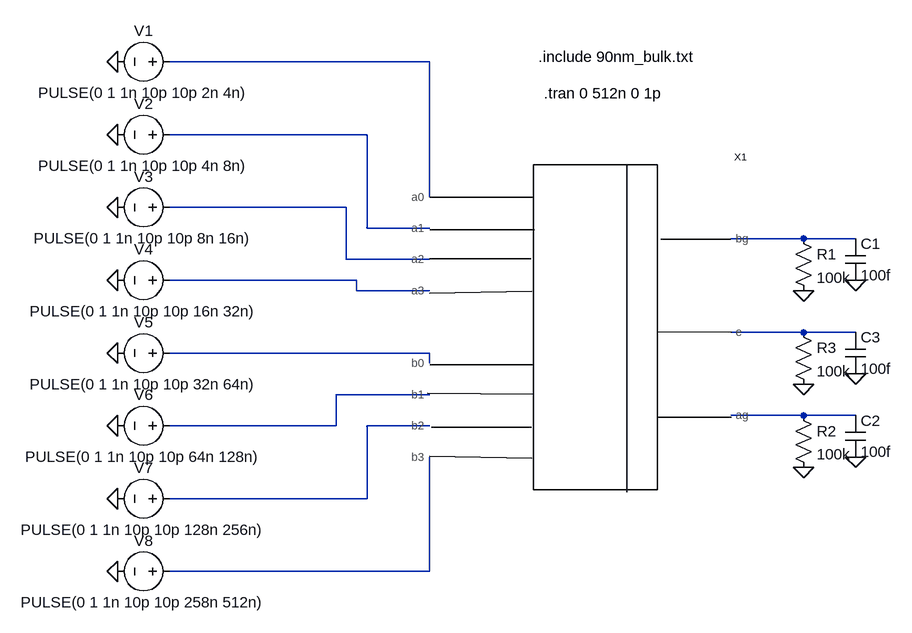
[diagram p0: schematic comparator_test.asc]
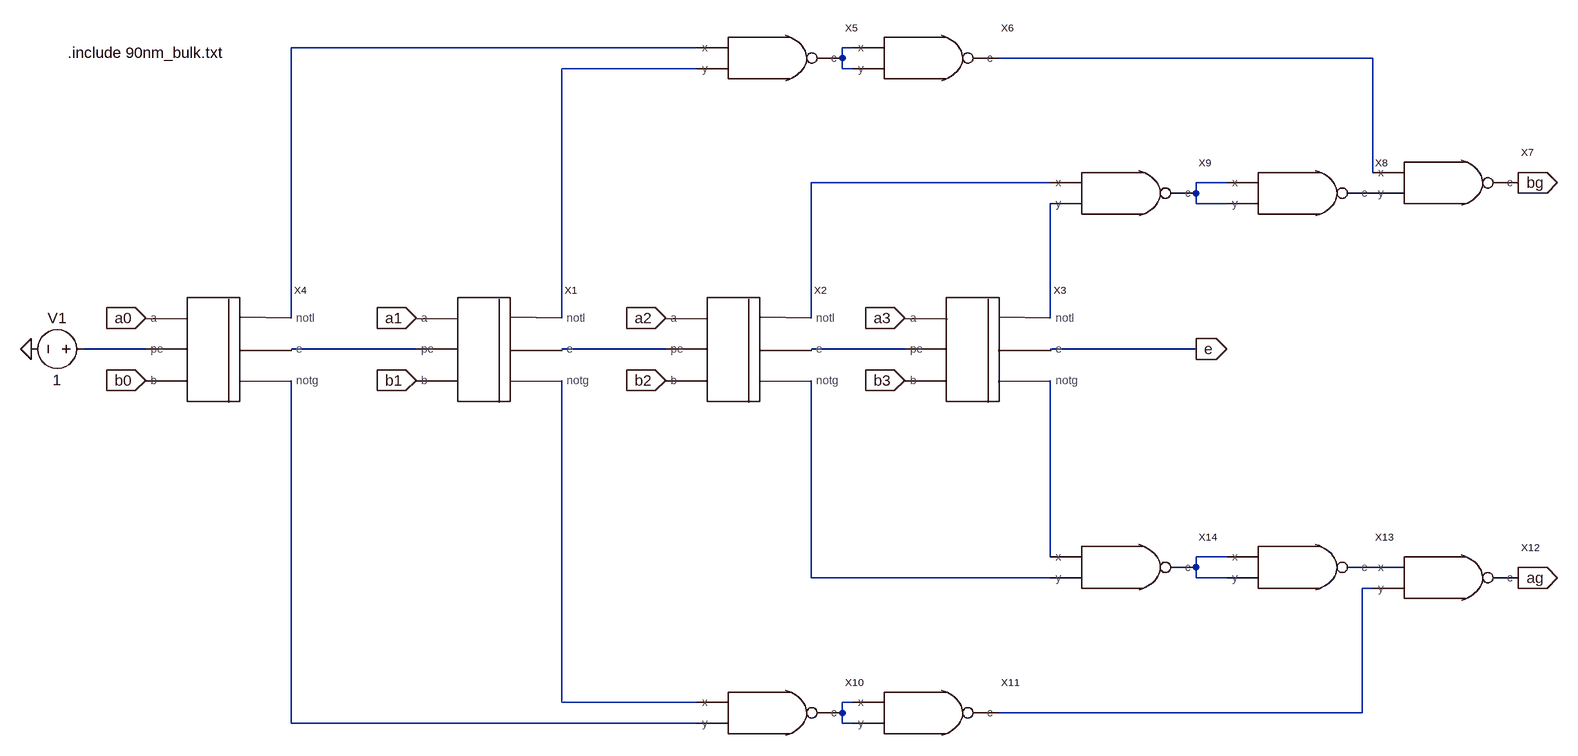
[diagram p1: sub-circuit comparator.asc]
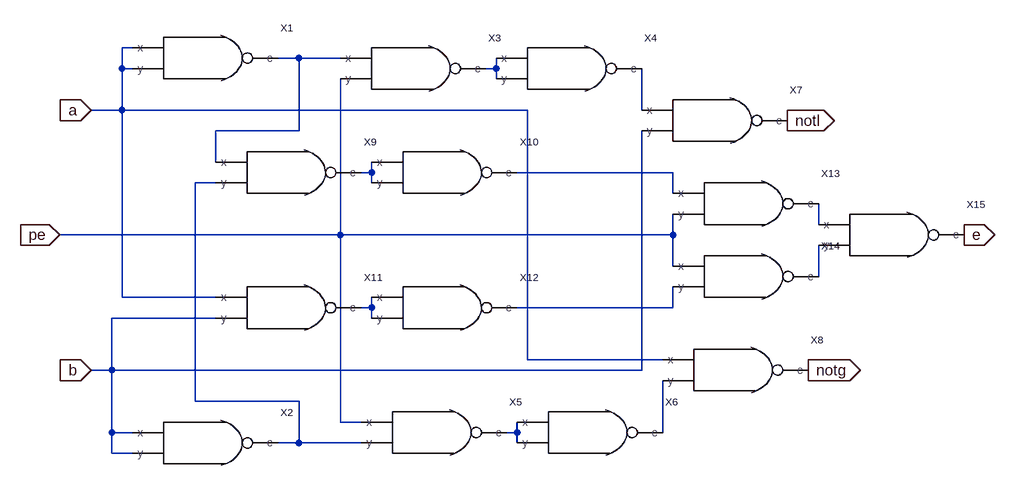
[diagram p2: sub-circuit one_comp.asc]
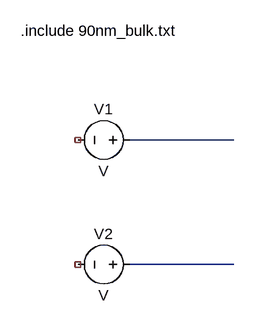
[diagram p3: sub-circuit nand.asc]
comparator_test.asc, the LTspice schematic file:
Version 4
SHEET 1 1072 704
WIRE 336 -176 -64 -176
WIRE 240 -64 -64 -64
WIRE 336 32 336 -176
WIRE 208 48 -64 48
WIRE 240 80 240 -64
WIRE 336 80 240 80
WIRE 912 96 800 96
WIRE 992 96 912 96
WIRE 208 128 208 48
WIRE 336 128 208 128
WIRE 224 160 -64 160
WIRE 224 176 224 160
WIRE 336 176 224 176
WIRE 912 240 800 240
WIRE 992 240 912 240
WIRE 336 272 -64 272
WIRE 336 288 336 272
WIRE 336 336 192 336
WIRE 912 368 800 368
WIRE 992 368 912 368
WIRE 192 384 192 336
WIRE 192 384 -64 384
WIRE 336 384 240 384
WIRE 240 496 240 384
WIRE 240 496 -64 496
WIRE 336 608 336 432
WIRE 336 608 -64 608
FLAG 912 176 0
FLAG 992 160 0
FLAG 912 448 0
FLAG 992 432 0
FLAG 912 320 0
FLAG 992 304 0
FLAG -144 -176 0
FLAG -144 -64 0
FLAG -144 48 0
FLAG -144 160 0
FLAG -144 272 0
FLAG -144 384 0
FLAG -144 496 0
FLAG -144 608 0
SYMBOL comparator 592 112 R0
SYMATTR InstName X1
SYMBOL voltage -48 -176 R90
WINDOW 0 -32 56 VBottom 2
WINDOW 3 32 56 VTop 2
WINDOW 123 0 0 Left 0
WINDOW 39 0 0 Left 0
SYMATTR InstName V1
SYMATTR Value PULSE(0 1 1n 10p 10p 2n 4n)
SYMBOL cap 976 96 R0
SYMATTR InstName C1
SYMATTR Value 100f
SYMBOL res 896 80 R0
SYMATTR InstName R1
SYMATTR Value 100k
SYMBOL cap 976 368 R0
SYMATTR InstName C2
SYMATTR Value 100f
SYMBOL res 896 352 R0
SYMATTR InstName R2
SYMATTR Value 100k
SYMBOL cap 976 240 R0
SYMATTR InstName C3
SYMATTR Value 100f
SYMBOL res 896 224 R0
SYMATTR InstName R3
SYMATTR Value 100k
SYMBOL voltage -48 -64 R90
WINDOW 0 -32 56 VBottom 2
WINDOW 3 32 56 VTop 2
WINDOW 123 0 0 Left 0
WINDOW 39 0 0 Left 0
SYMATTR InstName V2
SYMATTR Value PULSE(0 1 1n 10p 10p 4n 8n)
SYMBOL voltage -48 48 R90
WINDOW 0 -32 56 VBottom 2
WINDOW 3 32 56 VTop 2
WINDOW 123 0 0 Left 0
WINDOW 39 0 0 Left 0
SYMATTR InstName V3
SYMATTR Value PULSE(0 1 1n 10p 10p 8n 16n)
SYMBOL voltage -48 160 R90
WINDOW 0 -32 56 VBottom 2
WINDOW 3 32 56 VTop 2
WINDOW 123 0 0 Left 0
WINDOW 39 0 0 Left 0
SYMATTR InstName V4
SYMATTR Value PULSE(0 1 1n 10p 10p 16n 32n)
SYMBOL voltage -48 272 R90
WINDOW 0 -32 56 VBottom 2
WINDOW 3 32 56 VTop 2
WINDOW 123 0 0 Left 0
WINDOW 39 0 0 Left 0
SYMATTR InstName V5
SYMATTR Value PULSE(0 1 1n 10p 10p 32n 64n)
SYMBOL voltage -48 384 R90
WINDOW 0 -32 56 VBottom 2
WINDOW 3 32 56 VTop 2
WINDOW 123 0 0 Left 0
WINDOW 39 0 0 Left 0
SYMATTR InstName V6
SYMATTR Value PULSE(0 1 1n 10p 10p 64n 128n)
SYMBOL voltage -48 496 R90
WINDOW 0 -32 56 VBottom 2
WINDOW 3 32 56 VTop 2
WINDOW 123 0 0 Left 0
WINDOW 39 0 0 Left 0
SYMATTR InstName V7
SYMATTR Value PULSE(0 1 1n 10p 10p 128n 256n)
SYMBOL voltage -48 608 R90
WINDOW 0 -32 56 VBottom 2
WINDOW 3 32 56 VTop 2
WINDOW 123 0 0 Left 0
WINDOW 39 0 0 Left 0
SYMATTR InstName V8
SYMATTR Value PULSE(0 1 1n 10p 10p 258n 512n)
TEXT 504 -184 Left 2 !.include 90nm_bulk.txt
TEXT 512 -128 Left 2 !.tran 0 512n 0 1p

comparator.asc, the sub-circuit schematic file:
Version 4
SHEET 1 1768 968
WIRE 416 -320 -208 -320
WIRE 656 -320 640 -320
WIRE 640 -304 640 -320
WIRE 1456 -304 880 -304
WIRE 416 -288 208 -288
WIRE 640 -288 640 -304
WIRE 656 -288 640 -288
WIRE 1456 -128 1456 -304
WIRE 960 -112 592 -112
WIRE 1232 -112 1184 -112
WIRE 1184 -96 1184 -112
WIRE 1184 -80 1184 -96
WIRE 1232 -80 1184 -80
WIRE -208 96 -208 -320
WIRE 208 96 208 -288
WIRE 592 96 592 -112
WIRE 960 96 960 -80
WIRE -432 144 -528 144
WIRE -16 144 -208 144
WIRE 368 144 208 144
WIRE 736 144 592 144
WIRE 1184 144 960 144
WIRE 960 464 960 192
WIRE 1232 464 1184 464
WIRE 1184 480 1184 464
WIRE 592 496 592 192
WIRE 960 496 592 496
WIRE 1184 496 1184 480
WIRE 1232 496 1184 496
WIRE 1456 512 1440 512
WIRE 208 688 208 192
WIRE 416 688 208 688
WIRE 656 688 640 688
WIRE 640 704 640 688
WIRE 1440 704 1440 512
WIRE 1440 704 880 704
WIRE -208 720 -208 192
WIRE 416 720 -208 720
WIRE 640 720 640 704
WIRE 656 720 640 720
FLAG -432 96 a0
IOPIN -432 96 In
FLAG -16 96 a1
IOPIN -16 96 In
FLAG 368 96 a2
IOPIN 368 96 In
FLAG 736 96 a3
IOPIN 736 96 In
FLAG -432 192 b0
IOPIN -432 192 In
FLAG -16 192 b1
IOPIN -16 192 In
FLAG 368 192 b2
IOPIN 368 192 In
FLAG 736 192 b3
IOPIN 736 192 In
FLAG -608 144 0
FLAG 1680 -112 bg
IOPIN 1680 -112 Out
FLAG 1184 144 e
IOPIN 1184 144 Out
FLAG 1680 496 ag
IOPIN 1680 496 Out
SYMBOL one_comp 96 128 R0
SYMATTR InstName X1
SYMBOL one_comp 480 128 R0
SYMATTR InstName X2
SYMBOL one_comp 848 128 R0
SYMATTR InstName X3
SYMBOL one_comp -320 128 R0
SYMATTR InstName X4
SYMBOL voltage -512 144 R90
WINDOW 0 -32 56 VBottom 2
WINDOW 3 32 56 VTop 2
WINDOW 123 0 0 Left 0
WINDOW 39 0 0 Left 0
SYMATTR InstName V1
SYMATTR Value 1
SYMBOL nand 496 -320 R0
SYMATTR InstName X5
SYMBOL nand 736 -320 R0
SYMATTR InstName X6
SYMBOL nand 1536 -128 R0
SYMATTR InstName X7
SYMBOL nand 1312 -112 R0
SYMATTR InstName X8
SYMBOL nand 1040 -112 R0
SYMATTR InstName X9
SYMBOL nand 496 688 R0
SYMATTR InstName X10
SYMBOL nand 736 688 R0
SYMATTR InstName X11
SYMBOL nand 1536 480 R0
SYMATTR InstName X12
SYMBOL nand 1312 464 R0
SYMATTR InstName X13
SYMBOL nand 1040 464 R0
SYMATTR InstName X14
TEXT -552 -312 Left 2 !.include 90nm_bulk.txt

one_comp.asc, the sub-circuit schematic file:
Version 4
SHEET 1 1380 680
WIRE -80 -80 -96 -80
WIRE 176 -64 144 -64
WIRE 240 -64 176 -64
WIRE -96 -48 -96 -80
WIRE -80 -48 -96 -48
WIRE 480 -48 480 -64
WIRE 480 -48 464 -48
WIRE 480 -32 480 -48
WIRE -96 16 -96 -48
WIRE -96 16 -144 16
WIRE 528 16 -96 16
WIRE 704 16 704 -48
WIRE 176 48 176 -64
WIRE 176 48 48 48
WIRE 48 96 48 48
WIRE 288 112 288 96
WIRE 288 112 272 112
WIRE 752 112 512 112
WIRE 48 128 16 128
WIRE 288 128 288 112
WIRE 752 144 752 112
WIRE 976 192 976 160
WIRE 240 208 240 -32
WIRE 240 208 -192 208
WIRE 752 208 752 176
WIRE 752 208 240 208
WIRE 752 256 752 208
WIRE 976 272 976 224
WIRE -96 304 -96 16
WIRE 48 304 -96 304
WIRE 288 320 288 304
WIRE 288 320 272 320
WIRE 752 320 752 288
WIRE 752 320 512 320
WIRE 48 336 -112 336
WIRE 288 336 288 320
WIRE 528 400 528 16
WIRE 736 400 528 400
WIRE -112 416 -112 336
WIRE -112 416 -144 416
WIRE 704 416 704 48
WIRE 704 416 -112 416
WIRE 16 464 16 128
WIRE 176 464 16 464
WIRE 240 496 240 208
WIRE 272 496 240 496
WIRE -112 512 -112 416
WIRE -80 512 -112 512
WIRE 512 512 512 496
WIRE 512 512 496 512
WIRE 736 512 736 432
WIRE 176 528 176 464
WIRE 176 528 144 528
WIRE 272 528 176 528
WIRE 512 528 512 512
WIRE -112 544 -112 512
WIRE -80 544 -112 544
FLAG -144 16 a
IOPIN -144 16 In
FLAG -192 208 pe
IOPIN -192 208 In
FLAG -144 416 b
IOPIN -144 416 In
FLAG 928 32 notl
IOPIN 928 32 Out
FLAG 1200 208 e
IOPIN 1200 208 Out
FLAG 960 416 notg
IOPIN 960 416 Out
SYMBOL nand 0 -80 R0
SYMATTR InstName X1
SYMBOL nand 0 512 R0
SYMATTR InstName X2
SYMBOL nand 320 -64 R0
SYMATTR InstName X3
SYMBOL nand 560 -64 R0
SYMATTR InstName X4
SYMBOL nand 352 496 R0
SYMATTR InstName X5
SYMBOL nand 592 496 R0
SYMATTR InstName X6
SYMBOL nand 784 16 R0
SYMATTR InstName X7
SYMBOL nand 816 400 R0
SYMATTR InstName X8
SYMBOL nand 128 96 R0
SYMATTR InstName X9
SYMBOL nand 368 96 R0
SYMATTR InstName X10
SYMBOL nand 128 304 R0
SYMATTR InstName X11
SYMBOL nand 368 304 R0
SYMATTR InstName X12
SYMBOL nand 832 144 R0
SYMATTR InstName X13
SYMBOL nand 832 256 R0
SYMATTR InstName X14
SYMBOL nand 1056 192 R0
SYMATTR InstName X15

nand.asc, the sub-circuit schematic file:
Version 4
SHEET 1 880 680
WIRE 80 224 -80 224
WIRE 80 416 -80 416
SYMBOL voltage -64 224 R90
WINDOW 0 -32 56 VBottom 2
WINDOW 3 32 56 VTop 2
SYMATTR InstName V1
SYMBOL voltage -64 416 R90
WINDOW 0 -32 56 VBottom 2
WINDOW 3 32 56 VTop 2
SYMATTR InstName V2
TEXT -248 56 Left 2 !.include 90nm_bulk.txt

The netlist it stands for:
* comparator_test.asc
XX1 N001 N002 N003 N005 N007 N008 N010 N011 N004 N006 N009 comparator
V1 N001 0 PULSE(0 1 1n 10p 10p 2n 4n)
C1 N004 0 100f
R1 N004 0 100k
C2 N009 0 100f
R2 N009 0 100k
C3 N006 0 100f
R3 N006 0 100k
V2 N002 0 PULSE(0 1 1n 10p 10p 4n 8n)
V3 N003 0 PULSE(0 1 1n 10p 10p 8n 16n)
V4 N005 0 PULSE(0 1 1n 10p 10p 16n 32n)
V5 N007 0 PULSE(0 1 1n 10p 10p 32n 64n)
V6 N008 0 PULSE(0 1 1n 10p 10p 64n 128n)
V7 N010 0 PULSE(0 1 1n 10p 10p 128n 256n)
V8 N011 0 PULSE(0 1 1n 10p 10p 258n 512n)

* block symbol definitions
.subckt comparator a0 a1 a2 a3 b0 b1 b2 b3 bg e ag
XX1 a1 b1 N009 N004 N010 N016 one_comp
XX2 a2 b2 N010 N005 N011 N014 one_comp
XX3 a3 b3 N011 N007 e N012 one_comp
XX4 a0 b0 N008 N001 N009 N018 one_comp
V1 N008 0 1
XX5 N001 N004 N002 nand
XX6 N002 N002 N003 nand
XX7 N003 P001 bg nand
XX8 N006 N006 P001 nand
XX9 N005 N007 N006 nand
XX10 N016 N018 N017 nand
XX11 N017 N017 N015 nand
XX12 P002 N015 ag nand
XX13 N013 N013 P002 nand
XX14 N012 N014 N013 nand
.include 90nm_bulk.txt
.ends comparator

.subckt one_comp a b pe notl e notg
XX1 a a N001 nand
XX2 b b N006 nand
XX3 N001 pe N002 nand
XX4 N002 N002 N003 nand
XX5 pe N006 N011 nand
XX6 N011 N011 N012 nand
XX7 N003 b notl nand
XX8 a N012 notg nand
XX9 N001 N006 N004 nand
XX10 N004 N004 N005 nand
XX11 a b N009 nand
XX12 N009 N009 N010 nand
XX13 N005 pe N007 nand
XX14 pe N010 N008 nand
XX15 N007 N008 e nand
.ends one_comp

.subckt nand x y c
V1 N001 NC_01 V
V2 N002 NC_02 V
.include 90nm_bulk.txt
.ends nand

.include 90nm_bulk.txt
.tran 0 512n 0 1p
.backanno
.end